# EAGLE design RLY_1_0 (EAGLE 8.3.2)
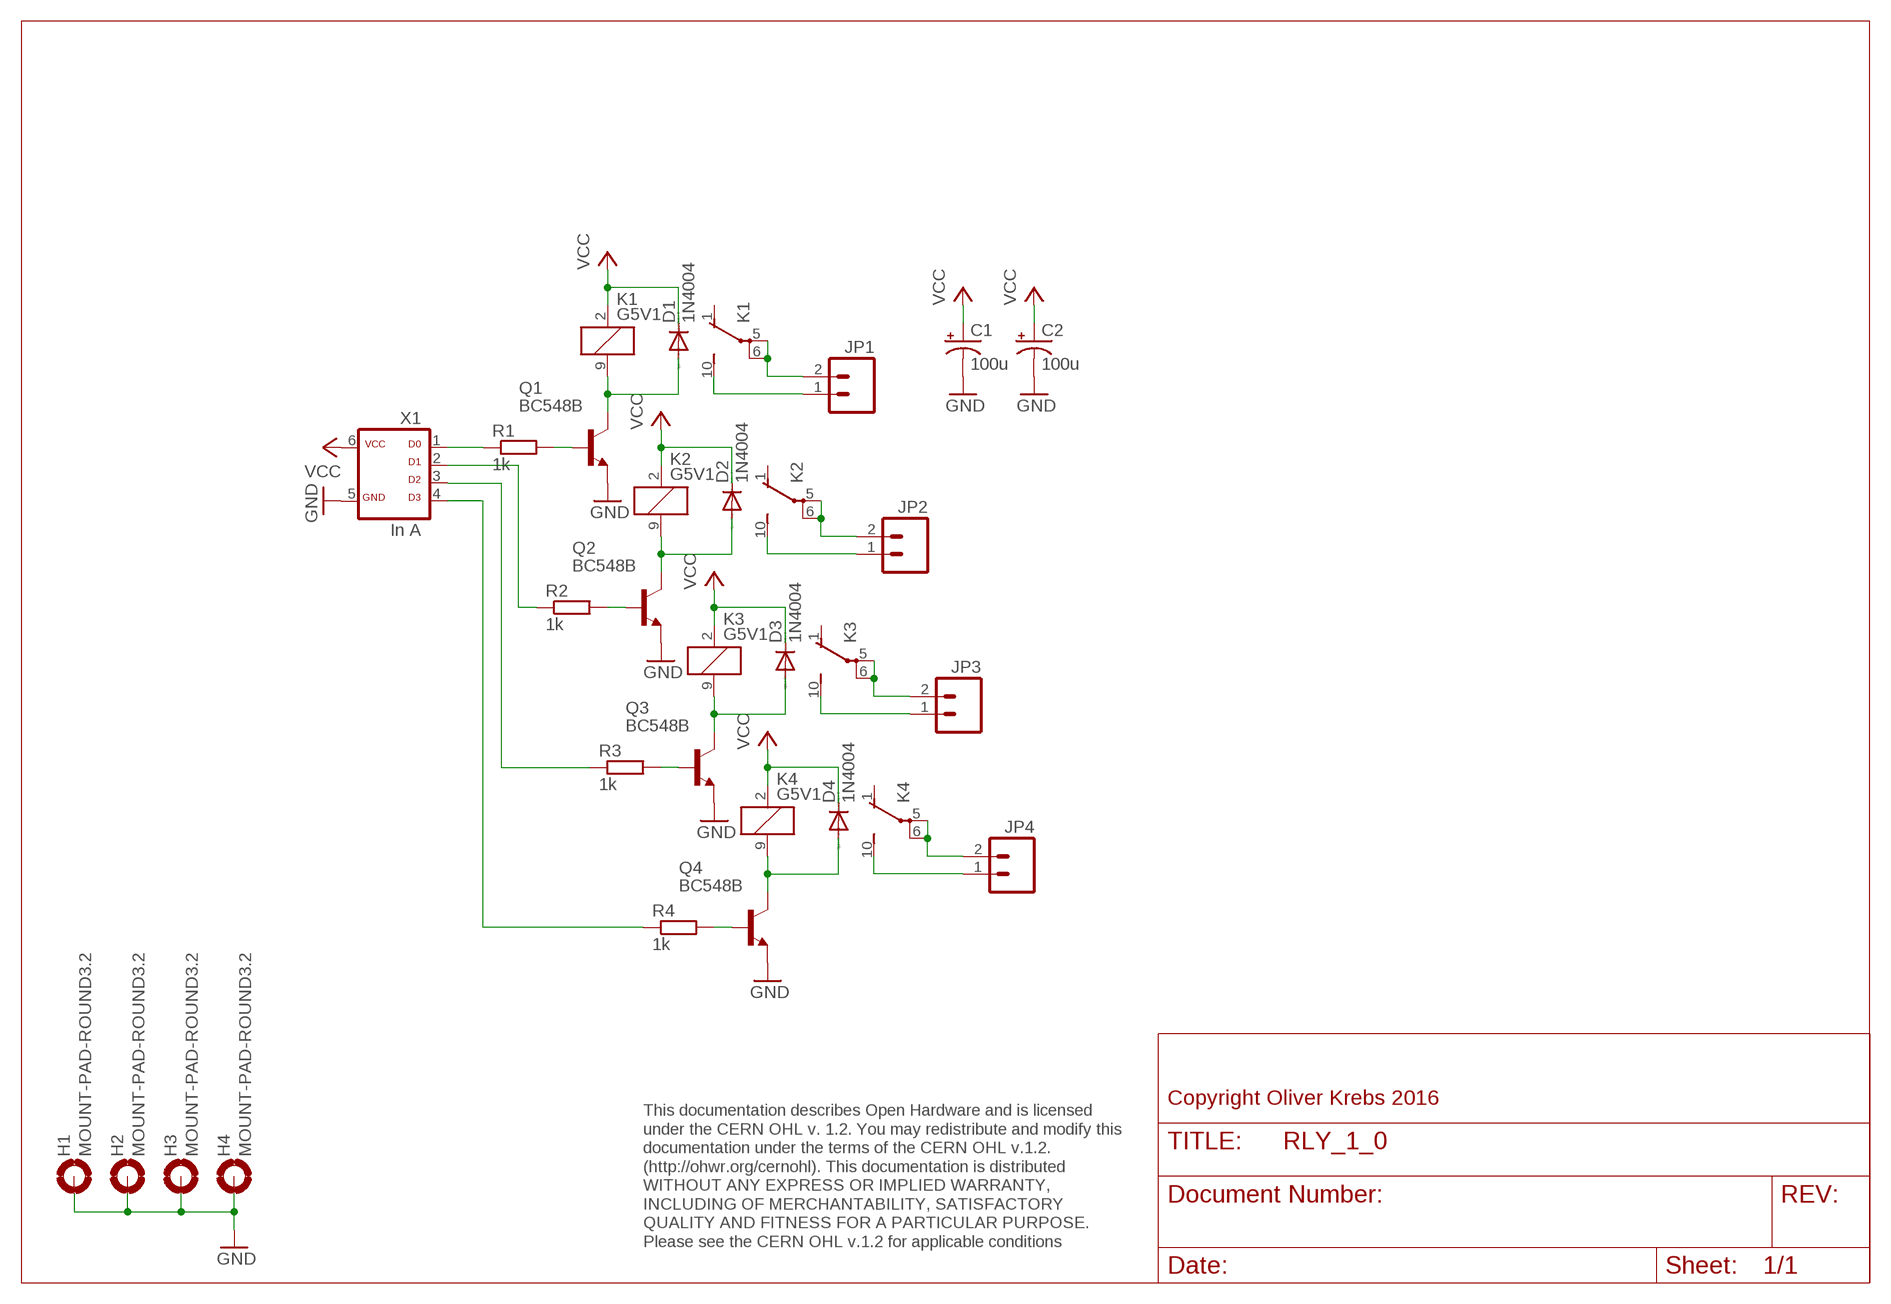
[diagram p0: schematic, sheet 1]

## Parts
C1  100u  CAP_POLPTH1  [CPOL-RADIAL-100UF-25V]
C2  100u  CAP_POLPTH1  [CPOL-RADIAL-100UF-25V]
D1  1N4004  [DO41-10]
D2  1N4004  [DO41-10]
D3  1N4004  [DO41-10]
D4  1N4004  [DO41-10]
H1  MOUNT-PAD-ROUND3.2  [3,2-PAD]
H2  MOUNT-PAD-ROUND3.2  [3,2-PAD]
H3  MOUNT-PAD-ROUND3.2  [3,2-PAD]
H4  MOUNT-PAD-ROUND3.2  [3,2-PAD]
JP1  M021.3MM-5.08  [1X02_BIG_5.08]
JP2  M021.3MM-5.08  [1X02_BIG_5.08]
JP3  M021.3MM-5.08  [1X02_BIG_5.08]
JP4  M021.3MM-5.08  [1X02_BIG_5.08]
K1  G5V1  [G5V1]
K2  G5V1  [G5V1]
K3  G5V1  [G5V1]
K4  G5V1  [G5V1]
Q1  BC548B  [TO92-EBC]
Q2  BC548B  [TO92-EBC]
Q3  BC548B  [TO92-EBC]
Q4  BC548B  [TO92-EBC]
R1  1k  R-EU_0207/10  [0207/10]
R2  1k  R-EU_0207/10  [0207/10]
R3  1k  R-EU_0207/10  [0207/10]
R4  1k  R-EU_0207/10  [0207/10]
X1  In A  ML6D  [ML-6]

## Nets
GND: C1.2(-) C2.2(-) H1.B3,2(MOUNT) H2.B3,2(MOUNT) H3.B3,2(MOUNT) H4.B3,2(MOUNT) Q1.E Q2.E Q3.E Q4.E X1.5
N$1: Q1.B R1.2
N$2: D1.A K1.9 Q1.C
N$3: JP1.1 K1.10(2:S)
N$4: JP1.2 K1.5(2:P) K1.6(2:P)
N$5: Q2.B R2.2
N$6: D2.A K2.9 Q2.C
N$7: JP2.1 K2.10(2:S)
N$8: JP2.2 K2.5(2:P) K2.6(2:P)
N$9: Q3.B R3.2
N$10: D3.A K3.9 Q3.C
N$11: JP3.1 K3.10(2:S)
N$12: JP3.2 K3.5(2:P) K3.6(2:P)
N$13: Q4.B R4.2
N$14: D4.A K4.9 Q4.C
N$15: JP4.1 K4.10(2:S)
N$16: JP4.2 K4.5(2:P) K4.6(2:P)
N$17: R1.1 X1.1
N$18: R2.1 X1.2
N$19: R3.1 X1.3
N$20: R4.1 X1.4
VCC: C1.1(+) C2.1(+) D1.C D2.C D3.C D4.C K1.2 K2.2 K3.2 K4.2 X1.6
Unconnected: K1.1(2:O) K2.1(2:O) K3.1(2:O) K4.1(2:O)

## Notes on the sheet
- Copyright Oliver Krebs 2016
- This documentation describes Open Hardware and is licensed 
  under the CERN OHL v. 1.2. You may redistribute and modify this 
  documentation under the terms of the CERN OHL v.1.2. 
  (http://ohwr.org/cernohl). This documentation is distributed
  WITHOUT ANY EXPRESS OR IMPLIED WARRANTY, 
  INCLUDING OF MERCHANTABILITY, SATISFACTORY 
  QUALITY AND FITNESS FOR A PARTICULAR PURPOSE. 
  Please see the CERN OHL v.1.2 for applicable conditions

## Library data of the parts
C1 C2 = SparkFun-Passives:CAP_POL: Capacitor Polarized These are standard SMD and PTH capacitors. Normally 10uF, 47uF, and 100uF in electrolytic and tantalum varieties. Always verify the external diameter of the through hole cap, it varies with capacity, voltage, and manufacturer. The EIA devices should be standard.
D1-D4 = diode:1N4004: DIODE general purpose rectifier, 1 A
H1-H4 = holes:MOUNT-PAD-ROUND: MOUNTING PAD, round
JP1-JP4 = SparkFun-Connectors:M02: Standard 2-pin 0.1" header. Use with - straight break away headers ( PRT-00116) - right angle break away headers (PRT-00553) - swiss pins (PRT-00743) - machine pins (PRT-00117) - female headers (PRT-00115) Molex polarized connector foot print use with: PRT-08233 with associated crimp pins and housings. 2.54_SCREWTERM for use with PRT-10571. 3.5mm Screw Terminal footprints for PRT-08084 5mm Screw Terminal footprints for use with PRT-08432
K1-K4 = relay:G5V1: RELAY 1 x switch, 0.5 A/125 V AC, 1 A/24 V DC , Omron; MPN: G5V-1-DC24; OC_FARNELL: 9949593; OC_NEWARK: 36M6377
Q1-Q4 = transistor-npn:BC548*: NPN Transistor
R1-R4 = 01-my_rcl:R-EU_: RESISTOR, European symbol
X1 = 01-my-con:ML6D

## Board
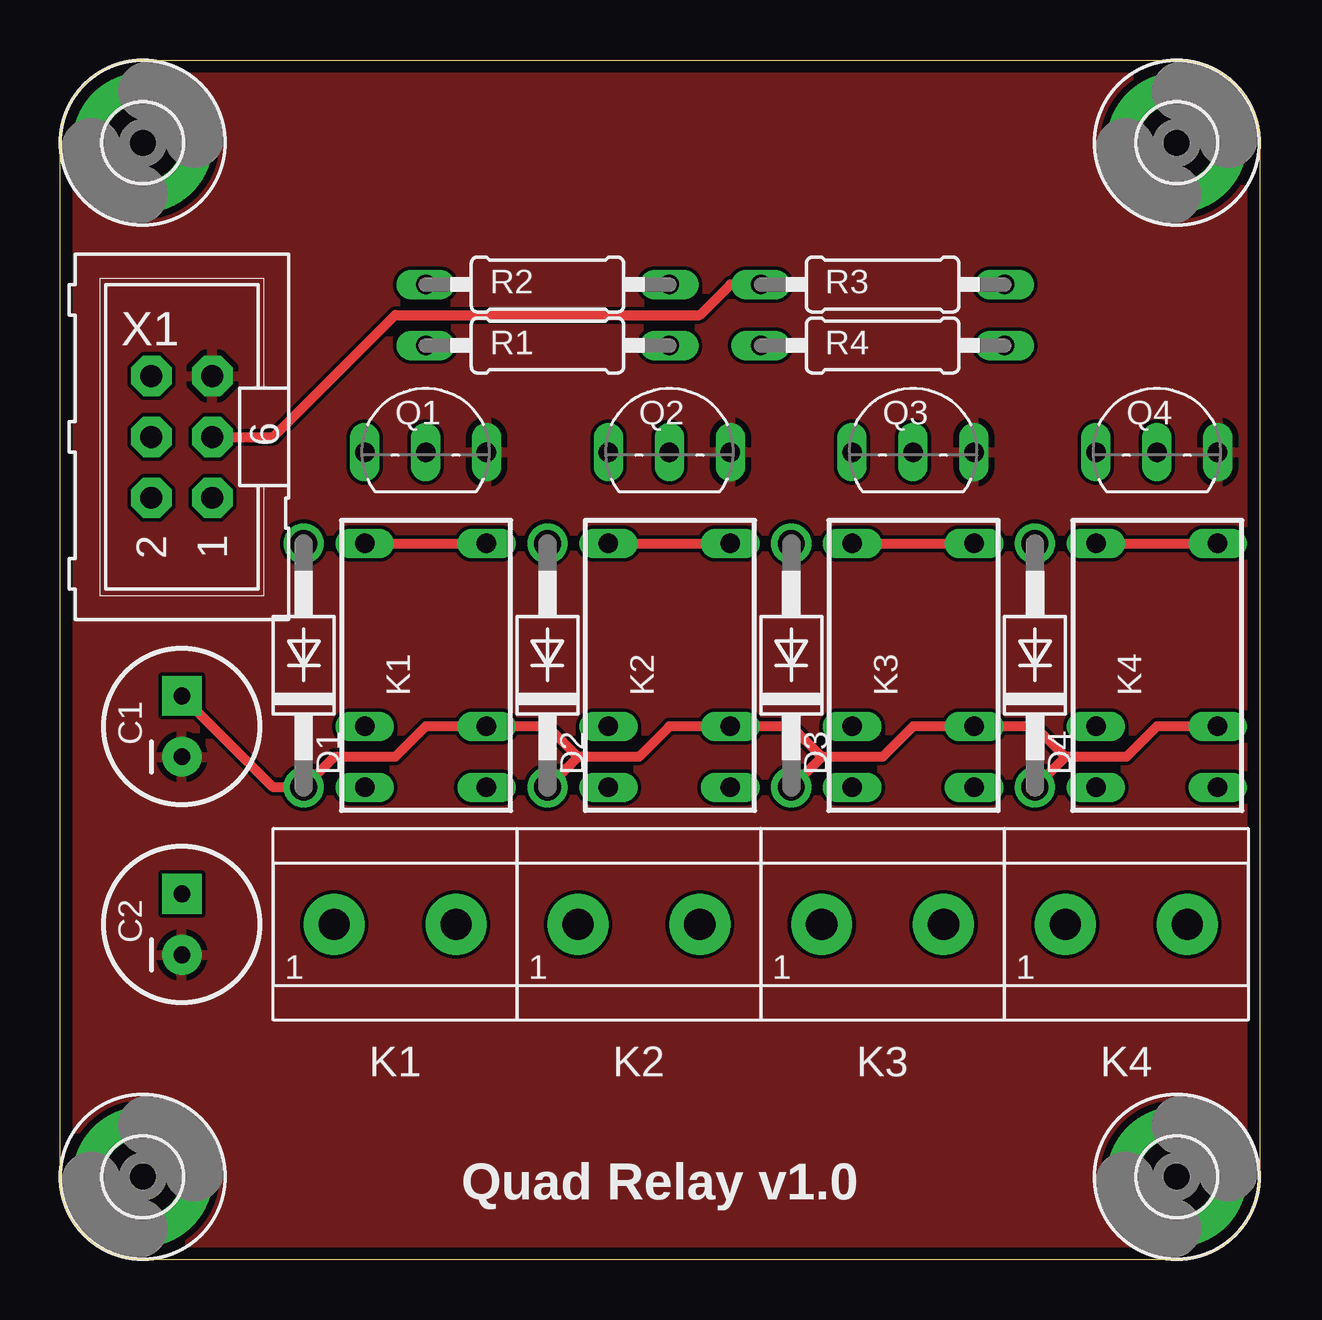
[diagram p1: board, top side]
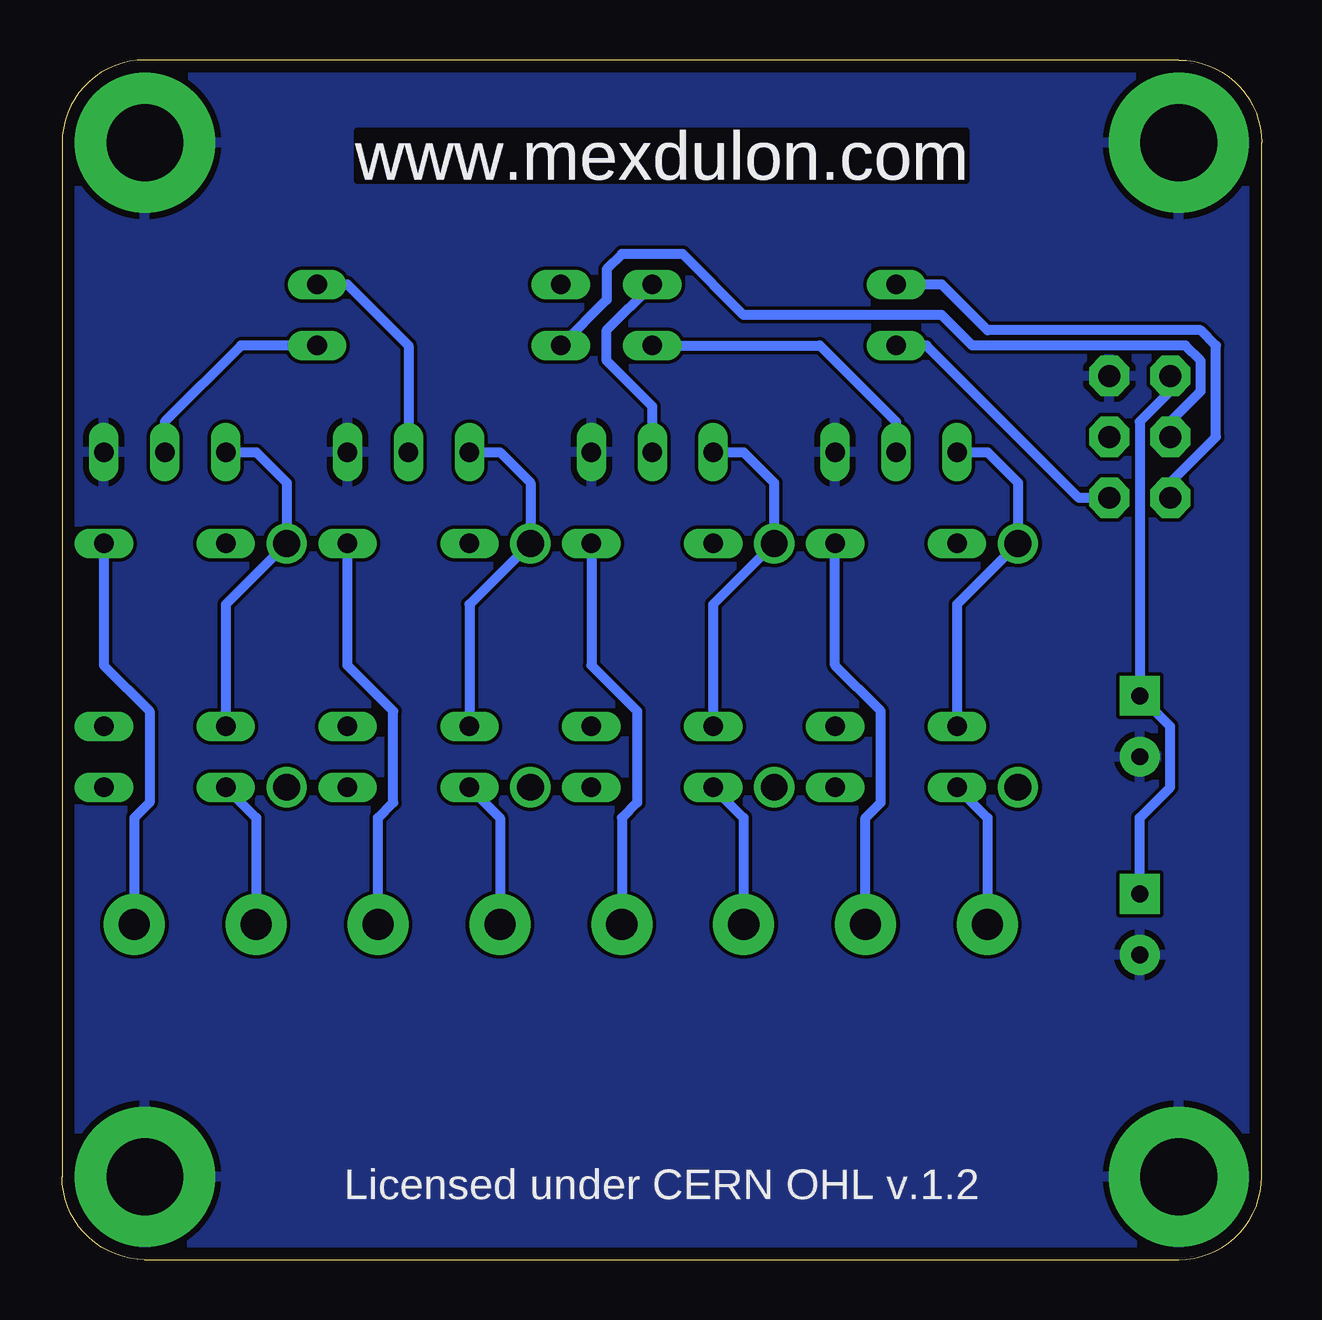
[diagram p2: board, bottom side, seen from below]

Size 50 x 50 mm. Coordinates in mm from the lower left corner, seen from the top.
Outline: 0,3.45 0,46.55 arc-90 3.45,50 46.55,50 arc-90 50,46.55 50,3.45 arc-90 46.55,0 3.45,0 arc-90 0,3.45
Copper layers (1*16): Top 0.035mm / dielectric 1.6mm / Bottom 0.035mm
Design rules "Elecrow_2-layer_PCB_eagle_rule": minimum track width 6mil, minimum drill 12mil, track to track 6mil, track to pad 6mil, pad to pad 6mil, via to via 8mil, smd to smd 0mil, copper to edge 20mil, drill to drill 10mil, minimum pad ring 6mil, minimum via ring 6mil, stop-mask expansion 0mil, vias tented up to drill 100mil, thermal gap 10mil

### Footprints (pad centres in the part's own frame; a part is rotated, then mirrored left to right if it is on the bottom)
CPOL-RADIAL-100UF-25V = drill 0.7 pad 1.651 square: 1 1.27,0 | drill 0.7 pad 1.651: 2 -1.27,0
DO41-10 = drill 1.118: A 5.08,0; C -5.08,0
3,2-PAD = drill 3.2 pad 5.842: B3,2 0,0
1X02_BIG_5.08 = drill 1.3 pad 2.54: 1 -2.54,0; 2 2.54,0
G5V1 = drill 0.813 long: 1 -5.08,-2.54; 2 -2.54,-2.54; 5 5.08,-2.54; 6 5.08,2.54; 9 -2.54,2.54; 10 -5.08,2.54
TO92-EBC = drill 0.813 long: B 0,-1.27; C -2.54,-1.27; E 2.54,-1.27
0207/10 = drill 0.813 long: 1 -5.08,0; 2 5.08,0
ML-6 = drill 0.914 pad 1.676 octagon: 1 -2.54,-1.27; 2 -2.54,1.27; 3 0,-1.27; 4 0,1.27; 5 2.54,-1.27; 6 2.54,1.27

### Placement (x,y rotation side)
C1  5.08,22.23 90 top
C2  5.08,13.97 90 top
D1  10.16,24.77 90 top
D2  20.32,24.77 90 top
D3  30.48,24.77 90 top
D4  40.64,24.77 90 top
H1  3.45,3.45 0 top
H2  3.45,46.55 0 top
H3  46.55,3.45 0 top
H4  46.55,46.55 0 top
JP1  13.97,13.97 0 top
JP2  24.13,13.97 0 top
JP3  34.29,13.97 0 top
JP4  44.45,13.97 0 top
K1  15.24,24.77 90 top
K2  25.4,24.77 90 top
K3  35.56,24.77 90 top
K4  45.72,24.77 90 top
Q1  15.24,34.92 0 top
Q2  25.4,34.92 0 top
Q3  35.56,34.92 0 top
Q4  45.72,34.92 0 top
R1  20.32,38.1 0 top
R2  20.32,40.64 0 top
R3  34.29,40.64 0 top
R4  34.29,38.1 0 top
X1  5.08,34.29 90 top

### Tracks (layer width: path | path; a pad name or v marks a point on that pad's centre or on a via)
GND
  pour Bottom: 0,0 50.8,0 50.8,50.8 0,50.8
  pour Top: 0,50.16 50.16,50.16 50.16,0 0,0
N$1
  Bottom 0.406: R1.2 18.41,38.1 15.24,34.92 Q1.B
N$2
  Bottom 0.406: K1.9 12.7,27.3 D1.A 10.16,32.38 11.43,33.66 Q1.C
N$3
  Bottom 0.406: K1.10 11.43,18.41 JP1.1
N$4
  Top 0.406: K1.6 K1.5
  Bottom 0.406: JP1.2 16.51,18.41 15.88,19.05 15.88,22.86 17.78,24.77 K1.5
N$5
  Bottom 0.406: Q2.B 25.4,35.56 27.3,37.47 27.3,38.73 R2.2
N$6
  Bottom 0.406: K2.9 22.86,27.3 D2.A 20.32,32.38 21.59,33.66 Q2.C
N$7
  Bottom 0.406: K2.10 21.59,18.41 JP2.1
N$8
  Top 0.406: K2.6 K2.5
  Bottom 0.406: K2.5 27.94,24.77 26.04,22.86 26.04,19.05 26.67,18.41 JP2.2
N$9
  Bottom 0.406: R3.2 38.1,40.64 35.56,38.1 Q3.B
N$10
  Bottom 0.406: K3.9 33.02,27.3 D3.A 30.48,32.38 31.75,33.66 Q3.C
N$11
  Bottom 0.406: K3.10 31.75,18.41 JP3.1
N$12
  Top 0.406: K3.6 K3.5
  Bottom 0.406: JP3.2 36.83,18.41 36.2,19.05 36.2,22.86 38.1,24.77 K3.5
N$13
  Bottom 0.406: R4.2 42.55,38.1 45.72,34.92 Q4.B
N$14
  Bottom 0.406: K4.9 43.18,27.3 D4.A 40.64,32.38 41.91,33.66 Q4.C
N$15
  Bottom 0.406: K4.10 41.91,18.41 JP4.1
N$16
  Top 0.406: K4.6 K4.5
  Bottom 0.406: K4.5 48.26,24.77 46.35,22.86 46.35,19.05 46.99,18.41 JP4.2
N$17
  Bottom 0.406: X1.1 7.62,31.75 13.97,38.1 R1.1
N$18
  Bottom 0.406: X1.2 3.81,32.38 1.91,34.29 1.91,38.1 2.54,38.73 11.43,38.73 13.34,40.64 R2.1
N$19
  Top 0.406: X1.3 8.89,34.29 13.97,39.37 26.67,39.37 27.94,40.64 R3.1
N$20
  Bottom 0.406: X1.4 3.81,34.92 2.54,36.2 2.54,37.47 3.17,38.1 12.06,38.1 13.34,39.37 21.59,39.37 24.13,41.91 26.67,41.91 27.3,41.27 27.3,40.01 R4.1
VCC
  Top 0.406: K4.2 45.72,22.23 44.45,20.95 41.91,20.95 | 41.91,20.95 40.64,22.23 K3.2 35.56,22.23 34.29,20.95 31.75,20.95 | 31.75,20.95 30.48,22.23 K2.2 25.4,22.23 24.13,20.95 21.59,20.95 | 21.59,20.95 20.32,22.23 K1.2 15.24,22.23 13.97,20.95 11.43,20.95 D1.C 8.89,19.68 C1.1 | D2.C 21.59,20.95 | D3.C 31.75,20.95 | D4.C 41.91,20.95
  Bottom 0.406: X1.6 3.81,36.2 5.08,34.92 C1.1 3.81,22.23 3.81,19.68 5.08,18.41 C2.1

### Text on the board
Bottom: www.mexdulon.com
tNames: K1 | K2 | K3 | K4 | Quad Relay v1.0
bNames: www.mexdulon.com | www.mexdulon.com | Licensed under CERN OHL v.1.2